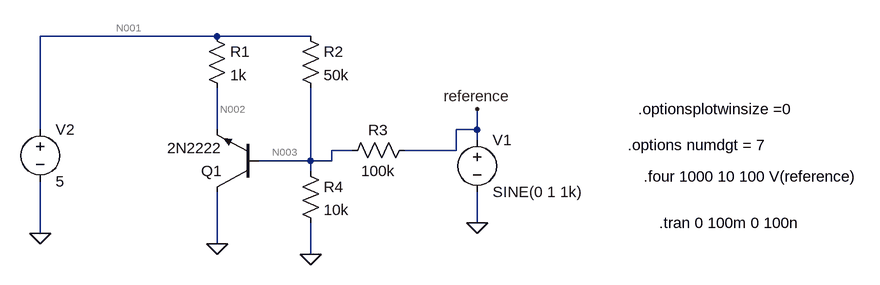
[diagram p0: schematic FTT.asc]
FTT.asc, the LTspice schematic file:
Version 4
SHEET 1 880 680
WIRE -224 -32 -496 -32
WIRE -80 -32 -224 -32
WIRE -496 112 -496 -32
WIRE -224 112 -224 48
WIRE 176 112 176 80
WIRE 176 112 144 112
WIRE 176 128 176 112
WIRE -16 144 -48 144
WIRE 144 144 144 112
WIRE 144 144 64 144
WIRE -80 160 -80 48
WIRE -80 160 -160 160
WIRE -48 160 -48 144
WIRE -48 160 -80 160
WIRE -80 176 -80 160
WIRE 176 256 176 208
WIRE -496 272 -496 192
WIRE -224 288 -224 208
WIRE -80 304 -80 256
FLAG 176 256 0
FLAG 176 80 reference
FLAG -80 304 0
FLAG -224 288 0
FLAG -496 272 0
SYMBOL voltage 176 112 R0
WINDOW 123 0 0 Left 0
WINDOW 39 0 0 Left 0
SYMATTR InstName V1
SYMATTR Value SINE(0 1 1k)
SYMBOL voltage -496 96 R0
WINDOW 123 0 0 Left 0
WINDOW 39 0 0 Left 0
SYMATTR InstName V2
SYMATTR Value 5
SYMBOL npn -160 208 R180
SYMATTR InstName Q1
SYMATTR Value 2N2222
SYMBOL res -240 -48 R0
SYMATTR InstName R1
SYMATTR Value 1k
SYMBOL res -96 -48 R0
SYMATTR InstName R2
SYMATTR Value 50k
SYMBOL res 80 128 R90
WINDOW 0 0 56 VBottom 2
WINDOW 3 32 56 VTop 2
SYMATTR InstName R3
SYMATTR Value 100k
SYMBOL res -96 160 R0
SYMATTR InstName R4
SYMATTR Value 10k
TEXT 456 256 Left 2 !.tran 0 100m 0 100n
TEXT 408 136 Left 2 !.options numdgt = 7
TEXT 424 80 Left 2 !.optionsplotwinsize =0
TEXT 432 184 Left 2 !.four 1000 10 100 V(reference)

The netlist it stands for:
* FTT.asc
V1 reference 0 SINE(0 1 1k)
V2 N001 0 5
Q1 0 N003 N002 0 2N2222
R1 N001 N002 1k
R2 N001 N003 50k
R3 reference N003 100k
R4 N003 0 10k
.model NPN NPN
.model PNP PNP
.lib standard.bjt
.tran 0 100m 0 100n
.options numdgt = 7
.optionsplotwinsize =0
.four 1000 10 100 V(reference)
.backanno
.end

* Results of the author's LTspice run, read from the files saved beside the schematic
* Operating Point, zero values left out:
*   V(n001) = 5 V
*   V(n003) = 587 mV
*   V(n002) = 4.929 V
*   Ic(Q1) = -94.35 µA
*   Ib(Q1) = 23.69 µA
*   Ie(Q1) = 70.65 µA
*   I(R4) = 58.7 µA
*   I(R3) = -5.87 µA
*   I(R2) = 88.26 µA
*   I(R1) = 70.65 µA
*   I(V2) = -158.9 µA
*   I(V1) = 5.87 µA